# Altium schematic sheet MicroPlayerSCH.SchDoc
size A2; SheetNumber: 1; SheetTotal: 1
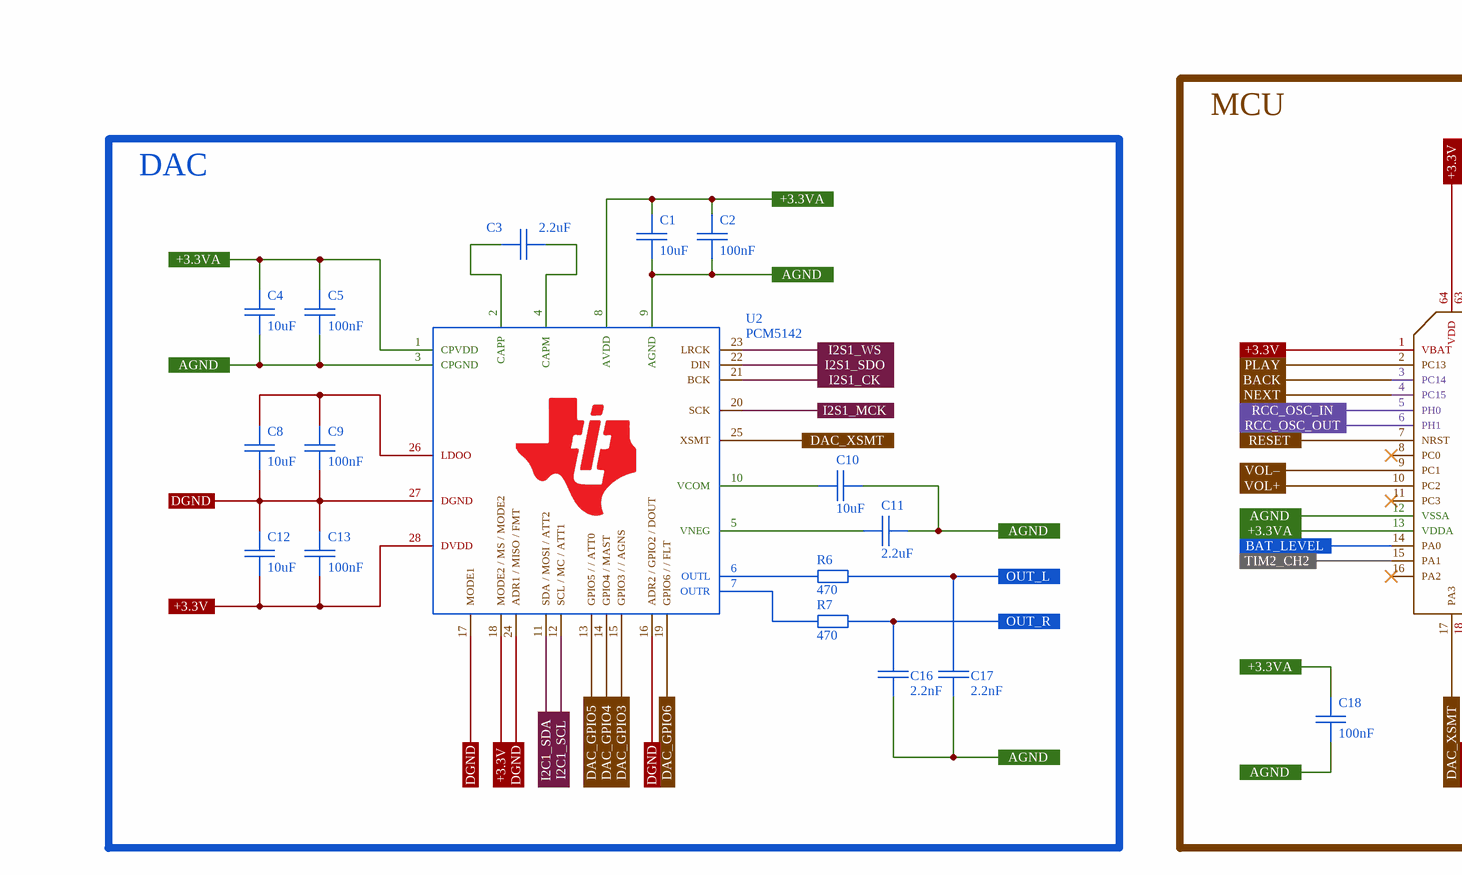
[diagram p0: MicroPlayerSCH.SchDoc, top left]
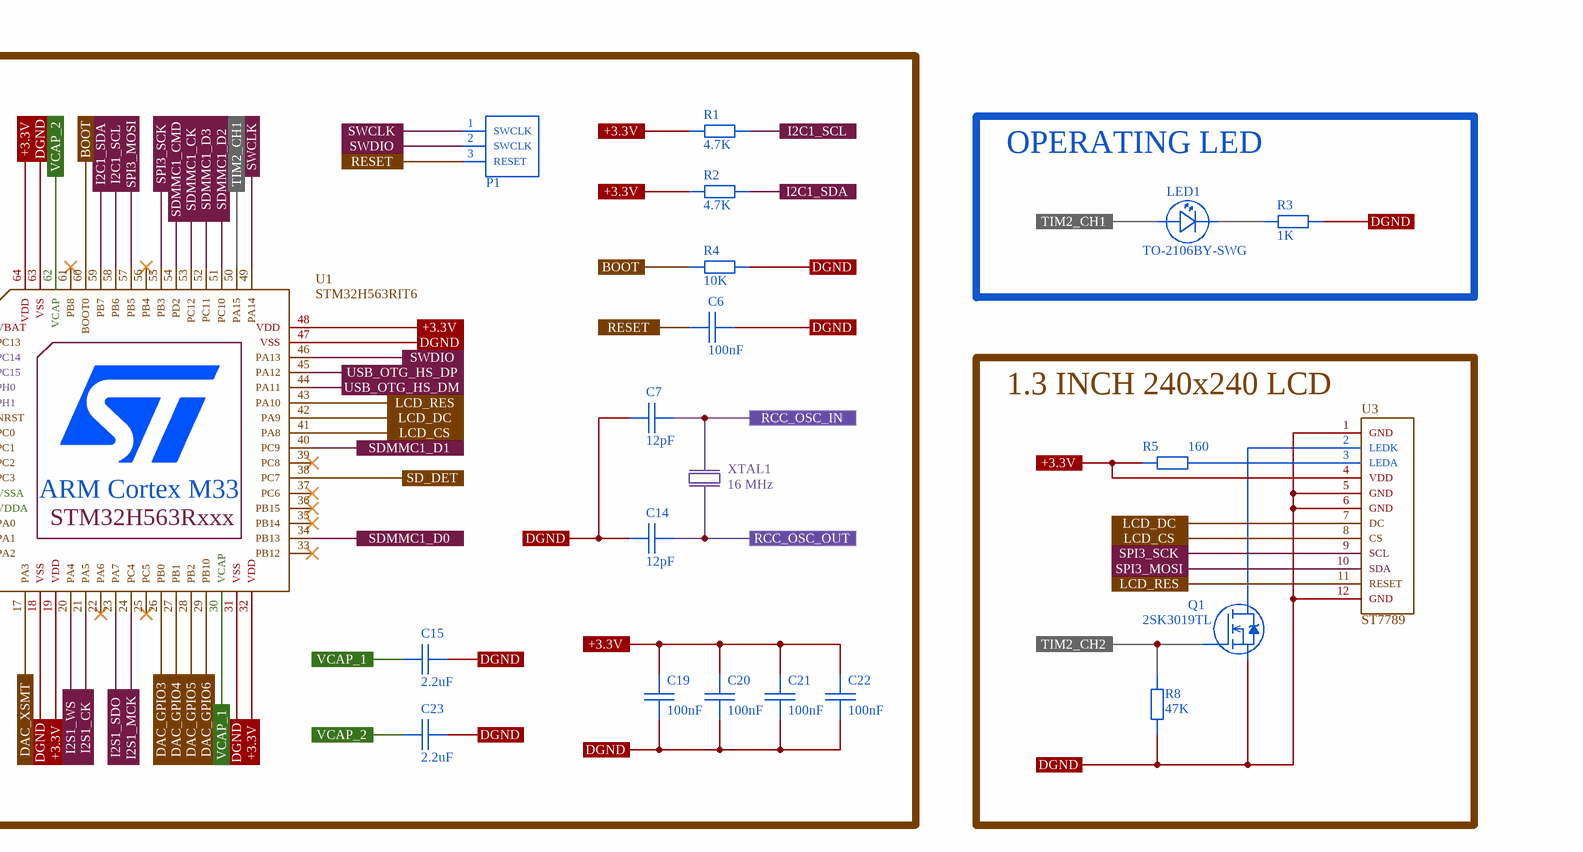
[diagram p1: MicroPlayerSCH.SchDoc, top right]
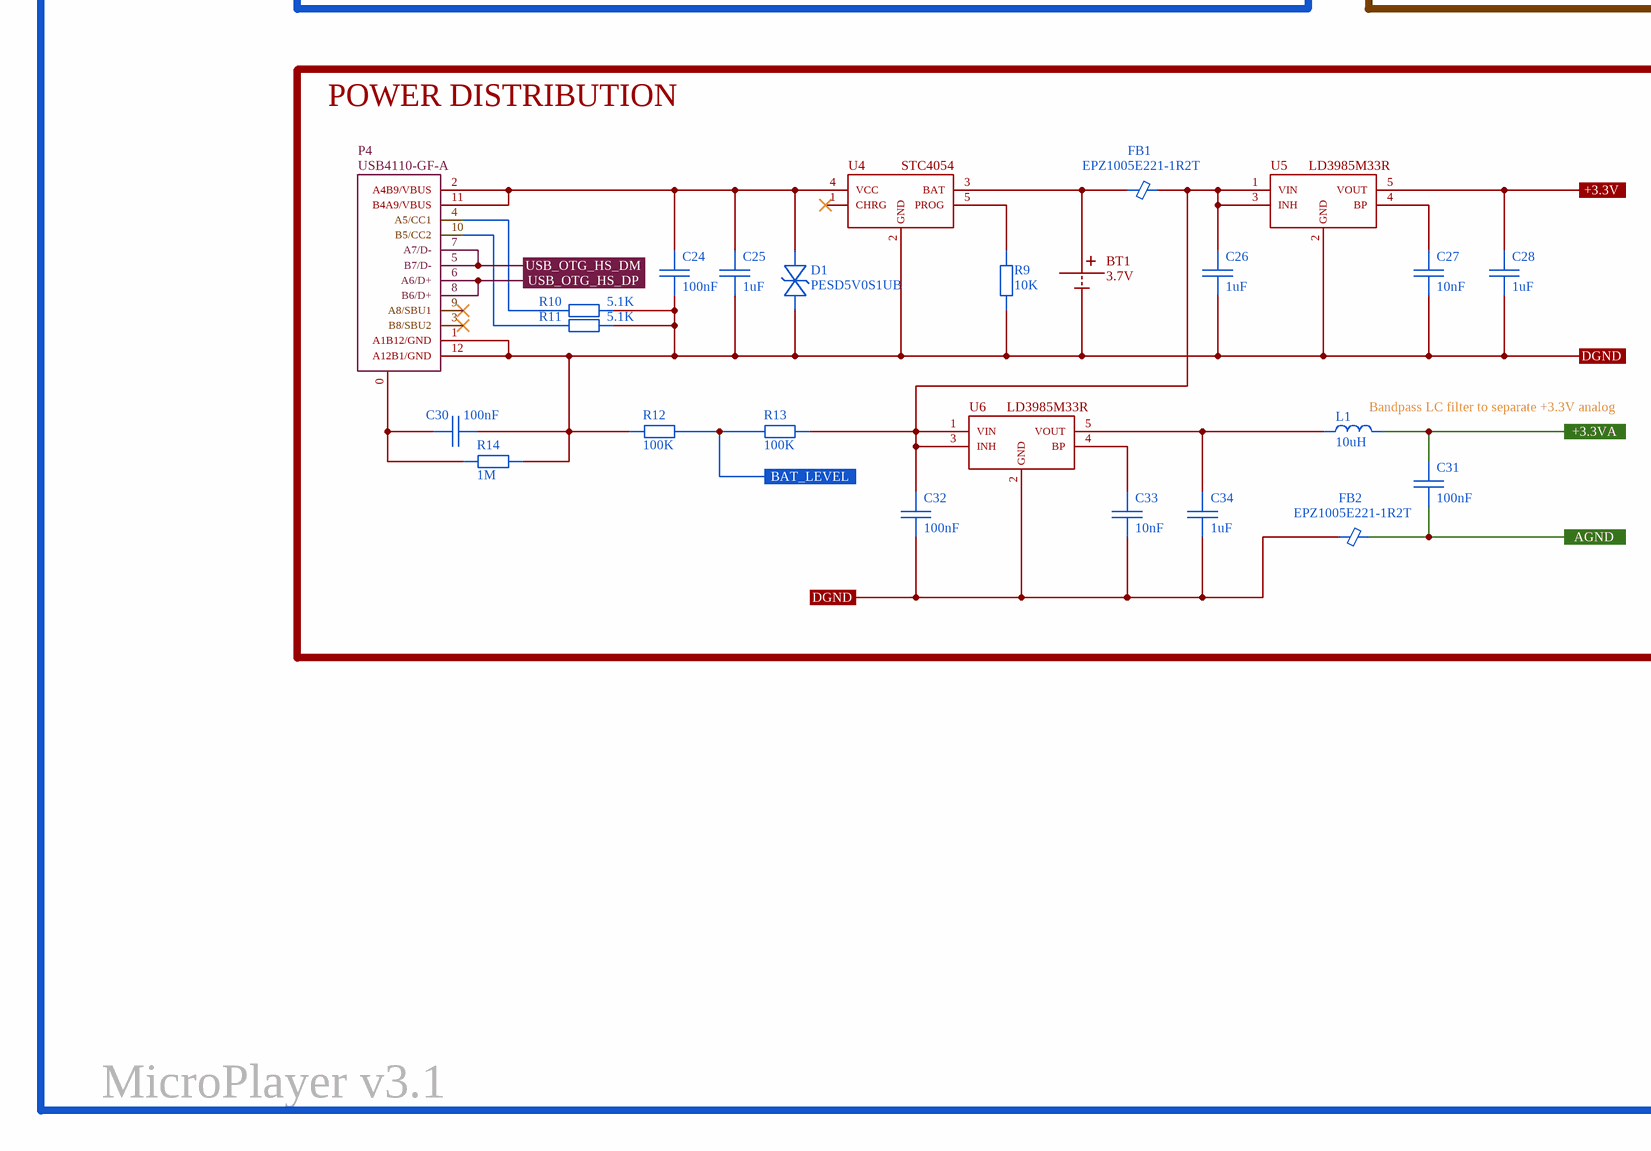
[diagram p2: MicroPlayerSCH.SchDoc, bottom left]
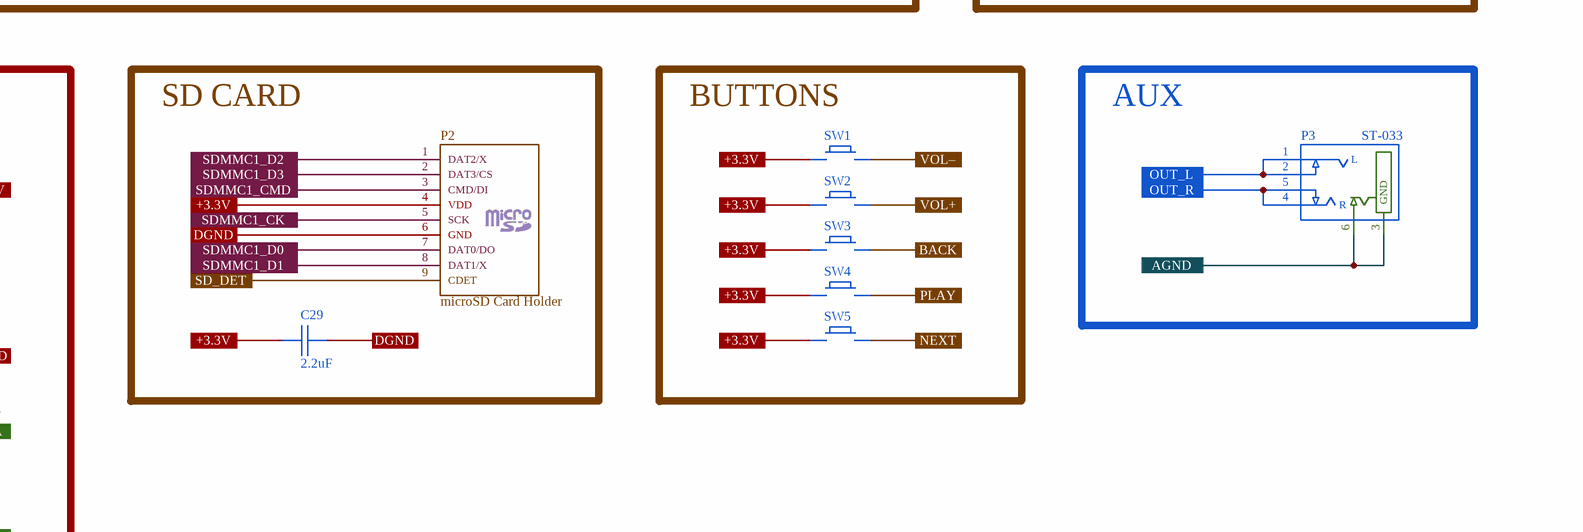
[diagram p3: MicroPlayerSCH.SchDoc, bottom right]

## Parts
BT1  3.7V  [_2-PAD-SM]
C1  10uF  [C0402]
C2  100nF  [C0402]
C3  2.2uF  [C0402]
C4  10uF  [C0402]
C5  100nF  [C0402]
C6  100nF  [C0402]
C7  12pF  [C0402]
C8  10uF  [C0402]
C9  100nF  [C0402]
C10  10uF  [C0402]
C11  2.2uF  [C0402]
C12  10uF  [C0402]
C13  100nF  [C0402]
C14  12pF  [C0402]
C15  2.2uF  [C0402]
C16  2.2nF  [C0402]
C17  2.2nF  [C0402]
C18  100nF  [C0402]
C19  100nF  [C0402]
C20  100nF  [C0402]
C21  100nF  [C0402]
C22  100nF  [C0402]
C23  2.2uF  [C0402]
C24  100nF  [C0402]
C25  1uF  [C0402]
C26  1uF  [C0402]
C27  10nF  [C0402]
C28  1uF  [C0402]
C29  2.2uF  [C0402]
C30  100nF  [C0402]
C31  100nF  [C0402]
C32  100nF  [C0402]
C33  10nF  [C0402]
C34  1uF  [C0402]
D1  PESD5V0S1UB  [SOD-523]
FB1  EPZ1005E221-1R2T  [L0402]
FB2  EPZ1005E221-1R2T  [L0402]
L1  10uH  [L0603]
LED1  TO-2106BY-SWG  [LED-2106-R/A]
P1  P3  [_3-PAD-SM]  (value not drawn)
P2  microSD Card Holder  [L-KLS1-TF-003]
P3  ST-033  [_3-PAD-TH]
P4  USB4110-GF-A  [USB-TYPE-C]
Q1  2SK3019TL  [SOT-416FL]
R1  4.7K  [R0402]
R2  4.7K  [R0402]
R3  1K  [R0402]
R4  10K  [R0402]
R5  160  [R0402]
R6  470  [R0402]
R7  470  [R0402]
R8  47K  [R0402]
R9  10K  [R0402]
R10  5.1K  [R0402]
R11  5.1K  [R0402]
R12  100K  [R0402]
R13  100K  [R0402]
R14  1M  [R0402]
SW1  (no value)  [BUT-SMD-4X3.5X2MM]
SW2  (no value)  [BUT-SMD-4X3.5X2MM]
SW3  (no value)  [BUT-SMD-4X3.5X2MM]
SW4  (no value)  [BUT-SMD-4X3.5X2MM]
SW5  (no value)  [BUT-SMD-4X3.5X2MM]
U1  STM32H563RIT6  [LQFP64]
U2  PCM5142  [TSSOP28]
U3  ST7789  [1.3INCH_LCD_WELDED]
U4  STC4054  [SOT-23-5]
U5  LD3985M33R  [SOT-23-5]
U6  LD3985M33R  [SOT-23-5]
XTAL1  16 MHz  [7U]

## Blocks framed on the sheet
MCU: C6 C7 C14 C15 C18-C23 P1 R1 R2 R4 U1 XTAL1
DAC: C1-C5 C8-C13 C16 C17 R6 R7 U2
OPERATING LED: LED1 R3
1.3 INCH 240x240 LCD: Q1 R5 R8 U3
POWER DISTRIBUTION: BT1 C24-C28 C30-C34 D1 FB1 FB2 L1 P4 R9-R14 U4-U6
SD CARD: C29 P2
BUTTONS: SW1-SW5
AUX: P3

## Ports
+3.3V (see MicroPlayerSCH[1B], MicroPlayerSCH[2B], MicroPlayerSCH[4A], MicroPlayerSCH[4B], MicroPlayerSCH[4C], MicroPlayerSCH[5B], MicroPlayerSCH[5C], MicroPlayerSCH[6A], MicroPlayerSCH[6B], MicroPlayerSCH[6C]), +3.3V (see MicroPlayerSCH[1B], MicroPlayerSCH[2B], MicroPlayerSCH[4A], MicroPlayerSCH[4B], MicroPlayerSCH[4C], MicroPlayerSCH[5B], MicroPlayerSCH[5C], MicroPlayerSCH[6A], MicroPlayerSCH[6B], MicroPlayerSCH[6C], MicroPlayerSCH[7B]), +3.3V (see MicroPlayerSCH[1B], MicroPlayerSCH[2B], MicroPlayerSCH[4A], MicroPlayerSCH[4B], MicroPlayerSCH[4C], MicroPlayerSCH[5B], MicroPlayerSCH[5C], MicroPlayerSCH[6B], MicroPlayerSCH[6C], MicroPlayerSCH[7B]), +3.3V (see MicroPlayerSCH[1B], MicroPlayerSCH[2B], MicroPlayerSCH[4A], MicroPlayerSCH[4B], MicroPlayerSCH[5B], MicroPlayerSCH[5C], MicroPlayerSCH[6A], MicroPlayerSCH[6B], MicroPlayerSCH[6C], MicroPlayerSCH[7B]), +3.3V (see MicroPlayerSCH[1B], MicroPlayerSCH[2B], MicroPlayerSCH[4B], MicroPlayerSCH[4C], MicroPlayerSCH[5B], MicroPlayerSCH[5C], MicroPlayerSCH[6A], MicroPlayerSCH[6B], MicroPlayerSCH[6C], MicroPlayerSCH[7B]), +3.3V (see MicroPlayerSCH[1B], MicroPlayerSCH[4A], MicroPlayerSCH[4B], MicroPlayerSCH[4C], MicroPlayerSCH[5B], MicroPlayerSCH[5C], MicroPlayerSCH[6A], MicroPlayerSCH[6B], MicroPlayerSCH[6C], MicroPlayerSCH[7B]), +3.3V (see MicroPlayerSCH[2B], MicroPlayerSCH[4A], MicroPlayerSCH[4B], MicroPlayerSCH[4C], MicroPlayerSCH[5B], MicroPlayerSCH[5C], MicroPlayerSCH[6A], MicroPlayerSCH[6B], MicroPlayerSCH[6C], MicroPlayerSCH[7B]), +3.3VA (see MicroPlayerSCH[1B], MicroPlayerSCH[3A], MicroPlayerSCH[4B]), +3.3VA (see MicroPlayerSCH[1B], MicroPlayerSCH[3A], MicroPlayerSCH[4B], MicroPlayerSCH[4C]), +3.3VA (see MicroPlayerSCH[1B], MicroPlayerSCH[4B], MicroPlayerSCH[4C]), +3.3VA (see MicroPlayerSCH[3A], MicroPlayerSCH[4B], MicroPlayerSCH[4C]), AGND (see MicroPlayerSCH[1B], MicroPlayerSCH[3B], MicroPlayerSCH[4B], MicroPlayerSCH[4C]), AGND (see MicroPlayerSCH[1B], MicroPlayerSCH[3B], MicroPlayerSCH[4B], MicroPlayerSCH[4C], MicroPlayerSCH[7C]), AGND (see MicroPlayerSCH[1B], MicroPlayerSCH[3B], MicroPlayerSCH[4B], MicroPlayerSCH[7C]), AGND (see MicroPlayerSCH[3B], MicroPlayerSCH[4B], MicroPlayerSCH[4C], MicroPlayerSCH[7C]), BACK (see MicroPlayerSCH[4B]), BACK (see MicroPlayerSCH[6C]), BAT_LEVEL (see MicroPlayerSCH[2C]), BAT_LEVEL (see MicroPlayerSCH[4B]), BOOT (see MicroPlayerSCH[5A]), BOOT (see MicroPlayerSCH[6B]), DAC_GPIO3 (see MicroPlayerSCH[2B]), DAC_GPIO3 (see MicroPlayerSCH[5B]), DAC_GPIO4 (see MicroPlayerSCH[2B]), DAC_GPIO4 (see MicroPlayerSCH[5B]), DAC_GPIO5 (see MicroPlayerSCH[2B]), DAC_GPIO5 (see MicroPlayerSCH[5B]), DAC_GPIO6 (see MicroPlayerSCH[3B]), DAC_GPIO6 (see MicroPlayerSCH[5B]), DAC_XSMT (see MicroPlayerSCH[3B]), DAC_XSMT (see MicroPlayerSCH[4B]), DGND (see MicroPlayerSCH[1B], MicroPlayerSCH[2B], MicroPlayerSCH[2D], MicroPlayerSCH[4A], MicroPlayerSCH[4B], MicroPlayerSCH[4C], MicroPlayerSCH[5B], MicroPlayerSCH[5C], MicroPlayerSCH[6B], MicroPlayerSCH[7B]), DGND (see MicroPlayerSCH[1B], MicroPlayerSCH[2B], MicroPlayerSCH[2D], MicroPlayerSCH[4A], MicroPlayerSCH[4B], MicroPlayerSCH[4C], MicroPlayerSCH[5B], MicroPlayerSCH[5C], MicroPlayerSCH[6B], MicroPlayerSCH[7B], MicroPlayerSCH[8B]), DGND (see MicroPlayerSCH[1B], MicroPlayerSCH[2B], MicroPlayerSCH[2D], MicroPlayerSCH[4A], MicroPlayerSCH[4B], MicroPlayerSCH[4C], MicroPlayerSCH[5B], MicroPlayerSCH[5C], MicroPlayerSCH[6B], MicroPlayerSCH[8B]), DGND (see MicroPlayerSCH[1B], MicroPlayerSCH[2B], MicroPlayerSCH[2D], MicroPlayerSCH[4A], MicroPlayerSCH[4B], MicroPlayerSCH[5B], MicroPlayerSCH[5C], MicroPlayerSCH[6B], MicroPlayerSCH[7B], MicroPlayerSCH[8B]), DGND (see MicroPlayerSCH[1B], MicroPlayerSCH[2B], MicroPlayerSCH[2D], MicroPlayerSCH[4A], MicroPlayerSCH[4C], MicroPlayerSCH[5B], MicroPlayerSCH[5C], MicroPlayerSCH[6B], MicroPlayerSCH[7B], MicroPlayerSCH[8B]), DGND (see MicroPlayerSCH[1B], MicroPlayerSCH[2B], MicroPlayerSCH[2D], MicroPlayerSCH[4B], MicroPlayerSCH[4C], MicroPlayerSCH[5B], MicroPlayerSCH[5C], MicroPlayerSCH[6B], MicroPlayerSCH[7B], MicroPlayerSCH[8B]), DGND (see MicroPlayerSCH[1B], MicroPlayerSCH[2B], MicroPlayerSCH[4A], MicroPlayerSCH[4B], MicroPlayerSCH[4C], MicroPlayerSCH[5B], MicroPlayerSCH[5C], MicroPlayerSCH[6B], MicroPlayerSCH[7B], MicroPlayerSCH[8B]), DGND (see MicroPlayerSCH[2B], MicroPlayerSCH[2D], MicroPlayerSCH[4A], MicroPlayerSCH[4B], MicroPlayerSCH[4C], MicroPlayerSCH[5B], MicroPlayerSCH[5C], MicroPlayerSCH[6B], MicroPlayerSCH[7B], MicroPlayerSCH[8B]), I2C1_SCL (see MicroPlayerSCH[2B], MicroPlayerSCH[5B]), I2C1_SCL (see MicroPlayerSCH[2B], MicroPlayerSCH[6A]), I2C1_SCL (see MicroPlayerSCH[5B], MicroPlayerSCH[6A]), I2C1_SDA (see MicroPlayerSCH[2B], MicroPlayerSCH[5B]), I2C1_SDA (see MicroPlayerSCH[2B], MicroPlayerSCH[6B]), I2C1_SDA (see MicroPlayerSCH[5B], MicroPlayerSCH[6B]), I2S1_CK (see MicroPlayerSCH[3B]), I2S1_CK (see MicroPlayerSCH[5B]), I2S1_MCK (see MicroPlayerSCH[3B]), I2S1_MCK (see MicroPlayerSCH[5B]), I2S1_SDO (see MicroPlayerSCH[3B]), I2S1_SDO (see MicroPlayerSCH[5B]), I2S1_WS (see MicroPlayerSCH[3B]), I2S1_WS (see MicroPlayerSCH[4B]), LCD_CS (see MicroPlayerSCH[5B]), LCD_CS (see MicroPlayerSCH[7B]), LCD_DC (see MicroPlayerSCH[5B]), LCD_DC (see MicroPlayerSCH[7B]), LCD_RES (see MicroPlayerSCH[5B]), LCD_RES (see MicroPlayerSCH[7B]), NEXT (see MicroPlayerSCH[4B]), NEXT (see MicroPlayerSCH[6C]), OUT_L (see MicroPlayerSCH[3B]), OUT_L (see MicroPlayerSCH[7C]), OUT_R (see MicroPlayerSCH[3B]), OUT_R (see MicroPlayerSCH[7C]), PLAY (see MicroPlayerSCH[4B]), PLAY (see MicroPlayerSCH[6C]), RCC_OSC_IN (see MicroPlayerSCH[4B]), RCC_OSC_IN (see MicroPlayerSCH[6B]), RCC_OSC_OUT (see MicroPlayerSCH[4B]), RCC_OSC_OUT (see MicroPlayerSCH[6B]), RESET (see MicroPlayerSCH[4B], MicroPlayerSCH[5A]), RESET (see MicroPlayerSCH[4B], MicroPlayerSCH[6B]), RESET (see MicroPlayerSCH[5A], MicroPlayerSCH[6B]), SD_DET (see MicroPlayerSCH[5B]), SD_DET (see MicroPlayerSCH[5C]), SDMMC1_CK (see MicroPlayerSCH[5B]), SDMMC1_CK (see MicroPlayerSCH[5C]), SDMMC1_CMD (see MicroPlayerSCH[5B]), SDMMC1_CMD (see MicroPlayerSCH[5C]), SDMMC1_D0 (see MicroPlayerSCH[5B]), SDMMC1_D0 (see MicroPlayerSCH[5C]), SDMMC1_D1 (see MicroPlayerSCH[5B]), SDMMC1_D1 (see MicroPlayerSCH[5C]), SDMMC1_D2 (see MicroPlayerSCH[5B]), SDMMC1_D2 (see MicroPlayerSCH[5C]), SDMMC1_D3 (see MicroPlayerSCH[5B]), SDMMC1_D3 (see MicroPlayerSCH[5C]), SPI3_MOSI (see MicroPlayerSCH[5B]), SPI3_MOSI (see MicroPlayerSCH[7B]), SPI3_SCK (see MicroPlayerSCH[5B]), SPI3_SCK (see MicroPlayerSCH[7B]), SWCLK (see MicroPlayerSCH[5A]), SWDIO (see MicroPlayerSCH[5A]), SWDIO (see MicroPlayerSCH[5B]), TIM2_CH1 (see MicroPlayerSCH[5B]), TIM2_CH1 (see MicroPlayerSCH[7B]), TIM2_CH2 (see MicroPlayerSCH[4B]), TIM2_CH2 (see MicroPlayerSCH[7B]), USB_OTG_HS_DM (see MicroPlayerSCH[2C]), USB_OTG_HS_DM (see MicroPlayerSCH[5B]), USB_OTG_HS_DP (see MicroPlayerSCH[2C]), USB_OTG_HS_DP (see MicroPlayerSCH[5B]), VCAP_1 (see MicroPlayerSCH[5B]), VCAP_2 (see MicroPlayerSCH[4A]), VCAP_2 (see MicroPlayerSCH[5B]), VOL+ (see MicroPlayerSCH[4B]), VOL+ (see MicroPlayerSCH[6C]), VOL– (see MicroPlayerSCH[4B]), VOL– (see MicroPlayerSCH[6C])

## Nets
+3.3V: C12.2 C13.2 C19.2 C20.2 C21.2 C22.2 C28.2 C29.1 P2.4(VDD) R1.1 R2.1 R5.1 SW1.1 SW2.1 SW3.1 SW4.1 SW5.1 U1.1(VBAT) U1.19(VDD) U1.32(VDD) U1.48(VDD) U1.64(VDD) U2.18(MODE2_/_MS_/_MODE2) U2.28(DVDD) U3.4(VDD) U5.5(VOUT) ; port +3.3V
+3.3VA: C1.1 C2.1 C4.1 C5.1 C18.2 C31.1 L1.2 U1.13(VDDA) U2.1(CPVDD) U2.8(AVDD) ; port +3.3VA
AGND: C1.2 C2.2 C4.2 C5.2 C10.2 C11.2 C16.1 C17.1 C18.1 C31.2 FB2.2 P3.3(GND) P3.6 U1.12(VSSA) U2.3(CPGND) U2.9(AGND) ; port AGND
BACK: SW3.2 U1.3(PC14) ; port BACK
BAT_LEVEL: R12.1 R13.2 U1.14(PA0) ; port BAT_LEVEL
BOOT: R4.1 U1.60(BOOT0) ; port BOOT
DAC_GPIO3: U1.26(PB0) U2.15(GPIO3_/_/_AGNS) ; port DAC_GPIO3
DAC_GPIO4: U1.27(PB1) U2.14(GPIO4_/_MAST) ; port DAC_GPIO4
DAC_GPIO5: U1.28(PB2) U2.13(GPIO5_/_/_ATT0) ; port DAC_GPIO5
DAC_GPIO6: U1.29(PB10) U2.19(GPIO6_/_/_FLT) ; port DAC_GPIO6
DAC_XSMT: U1.17(PA3) U2.25(XSMT) ; port DAC_XSMT
DGND: BT1.2 C6.1 C7.2 C8.2 C9.2 C12.1 C13.1 C14.2 C15.1 C19.1 C20.1 C21.1 C22.1 C23.1 C24.1 C25.2 C26.1 C27.1 C28.1 C29.2 C30.1 C32.1 C33.1 C34.1 D1.1 FB2.1 P2.6(GND) P4.1(A1B12/GND) P4.12(A12B1/GND) Q1.2(S) R3.1 R4.2 R8.1 R9.1 R10.1 R11.1 R12.2 R14.1 U1.18(VSS) U1.31(VSS) U1.47(VSS) U1.63(VSS) U2.16(ADR2_/_GPIO2_/_DOUT) U2.17(MODE1) U2.24(ADR1_/_MISO_/_FMT) U2.27(DGND) U3.1(GND) U3.5(GND) U3.6(GND) U3.12(GND) U4.2(GND) U5.2(GND) U6.2(GND) ; port DGND
I2C1_SCL: R1.2 U1.58(PB6) U2.12(SCL_/_MC_/_ATT1) ; port I2C1_SCL
I2C1_SDA: R2.2 U1.59(PB7) U2.11(SDA_/_MOSI_/_ATT2) ; port I2C1_SDA
I2S1_CK: U1.21(PA5) U2.21(BCK) ; port I2S1_CK
I2S1_MCK: U1.24(PC4) U2.20(SCK) ; port I2S1_MCK
I2S1_SDO: U1.23(PA7) U2.22(DIN) ; port I2S1_SDO
I2S1_WS: U1.20(PA4) U2.23(LRCK) ; port I2S1_WS
LCD_CS: U1.41(PA8) U3.8(CS) ; port LCD_CS
LCD_DC: U1.42(PA9) U3.7(DC) ; port LCD_DC
LCD_RES: U1.43(PA10) U3.11(RESET) ; port LCD_RES
NEXT: SW5.2 U1.4(PC15) ; port NEXT
OUT_L: C17.2 P3.1(L) P3.2 R6.1 ; port OUT_L
OUT_R: C16.2 P3.4(R) P3.5 R7.1 ; port OUT_R
PLAY: SW4.2 U1.2(PC13) ; port PLAY
RCC_OSC_IN: C7.1 U1.5(PH0) XTAL1.1 ; port RCC_OSC_IN
RCC_OSC_OUT: C14.1 U1.6(PH1) XTAL1.2 ; port RCC_OSC_OUT
RESET: C6.2 P1.3(RESET) U1.7(NRST) ; port RESET
SD_DET: P2.9(CDET) U1.38(PC7) ; port SD_DET
SDMMC1_CK: P2.5(SCK) U1.53(PC12) ; port SDMMC1_CK
SDMMC1_CMD: P2.3(CMD/DI) U1.54(PD2) ; port SDMMC1_CMD
SDMMC1_D0: P2.7(DAT0/DO) U1.34(PB13) ; port SDMMC1_D0
SDMMC1_D1: P2.8(DAT1/X) U1.40(PC9) ; port SDMMC1_D1
SDMMC1_D2: P2.1(DAT2/X) U1.51(PC10) ; port SDMMC1_D2
SDMMC1_D3: P2.2(DAT3/CS) U1.52(PC11) ; port SDMMC1_D3
SPI3_MOSI: U1.57(PB5) U3.10(SDA) ; port SPI3_MOSI
SPI3_SCK: U1.55(PB3) U3.9(SCL) ; port SPI3_SCK
SWCLK: P1.1(SWCLK) U1.49(PA14) ; port SWCLK
SWDIO: P1.2(SWCLK) U1.46(PA13) ; port SWDIO
TIM2_CH1: LED1.1(Anode) U1.50(PA15) ; port TIM2_CH1
TIM2_CH2: Q1.1(G) R8.2 U1.15(PA1) ; port TIM2_CH2
USB_OTG_HS_DM: P4.5(B7/D-) P4.7(A7/D-) U1.44(PA11) ; port USB_OTG_HS_DM
USB_OTG_HS_DP: P4.6(A6/D+) P4.8(B6/D+) U1.45(PA12) ; port USB_OTG_HS_DP
VCAP_1: C15.2 U1.30(VCAP) ; port VCAP_1
VCAP_2: C23.2 U1.62(VCAP) ; port VCAP_2
VOL+: SW2.2 U1.10(PC2) ; port VOL+
VOL–: SW1.2 U1.9(PC1) ; port VOL–
NetBT1_1: BT1.1 FB1.1 U4.3(BAT)
NetC3_1: C3.1 U2.2(CAPP)
NetC3_2: C3.2 U2.4(CAPM)
NetC8_1: C8.1 C9.1 U2.26(LDOO)
NetC10_1: C10.1 U2.10(VCOM)
NetC11_1: C11.1 U2.5(VNEG)
NetC24_2: C24.2 C25.1 D1.2 P4.2(A4B9/VBUS) P4.11(B4A9/VBUS) U4.4(VCC)
NetC26_2: C26.2 C32.2 FB1.2 R13.1 U5.1(VIN) U5.3(INH) U6.1(VIN) U6.3(INH)
NetC27_2: C27.2 U5.4(BP)
NetC30_2: C30.2 P4.0 R14.2
NetC33_2: C33.2 U6.4(BP)
NetC34_2: C34.2 L1.1 U6.5(VOUT)
NetLED1_2: LED1.2(Cathode) R3.2
NetP4_4: P4.4(A5/CC1) R10.2
NetP4_10: P4.10(B5/CC2) R11.2
NetQ1_3: Q1.3(D) U3.2(LEDK)
NetR5_2: R5.2 U3.3(LEDA)
NetR6_2: R6.2 U2.6(OUTL)
NetR7_2: R7.2 U2.7(OUTR)
NetR9_2: R9.2 U4.5(PROG)

Not connected (* = marked no-connect by the designer): P4 3(B8/SBU2)* 9(A8/SBU1)*; U1 8(PC0)* 11(PC3)* 16(PA2)* 22(PA6)* 25(PC5)* 33(PB12)* 35(PB14)* 36(PB15)* 37(PC6)* 39(PC8)* 56(PB4)* 61(PB8)*; U4 1(CHRG)*

## Notes on the sheet
- (near L1) Bandpass LC filter to separate +3.3V analog
- MicroPlayer v3.1
- (in symbol STM32H563Rxxx) ARM Cortex M33

## Library data of the parts
BT1 = Battery: Name: LP303030; Value: 3.7V; Link: https://www.chipdip.ru/product/robiton-lp303030
C1-C34 = Cap: Voltage: 250V; Tolerance: 5%
  C1 C4 C8 C10 C12: Value: 10uF; Case: DNP; Part Number: N/A; Link: *; Note: *
  C2 C5 C9 C13 C31: Value: 100nF; Case: 0603
  C3 C11 C15 C23 C29: Value: 2.2uF; Case: DNP; Part Number: N/A; Link: *; Note: *
  C6 C18-C22 C24 C30 C32: Value: 100nF; Case: DNP; Part Number: N/A; Link: *; Note: *
  C7 C14: Value: 12pF; Case: 0603
  C16 C17: Value: 2.2nF; Case: DNP; Part Number: N/A; Link: *; Note: *
  C25 C26 C28 C34: Value: 1uF; Case: DNP; Part Number: N/A; Link: *; Note: *
  C27 C33: Value: 10nF; Case: DNP; Part Number: N/A; Link: *; Note: *
D1 = Suppressor: Name: PESD5V0S1UB; Case: SOD-523; Link: https://www.chipdip.ru/product/pesd5v0s1ub
FB1 FB2 = Ferrite Bead: Value: 100uH; Name: EPZ1005E221-1R2T; Case: 0402
L1 = Inductor: Part Number: LQM21FN100N00K; Tolerance: 30%; Value: 10uH; Case: 0805; Link: https://www.chipdip.ru/product/lqm21fn100n
LED1 = LED: Name: TO-2106BY-SWG; Case: DNP; Part Number: N/A
P2 = MicroSD-CD1: Name: microSD Card Holder
P3 = AJack Socket Stereo: pin to pad: 2>1 4>2 5>2 6>3; Name: ST-033
P4 = USB Type C with 0: Name: USB4110-GF-A; Case: DNP; Part Number: N/A; Link: *; Note: *
Q1 = MOSFET-N: Name: 2SK3019TL; Case: SOT-416; Link: https://www.chipdip.ru/product/2n7002-umw
R1-R14 = Res: Tolerance: 5%; Power: 0.125W
  R1 R2: Value: 4.7K
  R3: Value: 1K; Case: 0603
  R4 R9: Value: 10K
  R5: Value: 160
  R6 R7: Value: 470
  R8: Value: 47K
  R10 R11: Value: 5.1K
  R12 R13: Value: 100K
  R14: Value: 1M
SW1-SW5 = Button
U1 = STM32H563Rxxx: Name: STM32H563RIT6; Case: DNP; Part Number: N/A
U2 = PCM514x: 2-VRMS DirectPath™, 112/106-dB Audio Stereo DAC With 32-bit, 384-kHz PCM Interface; Name: PCM5142; Case: DNP; Part Number: N/A; Link: *; Note: *
U3 = 1.3inch TFT LCD 12-pin: 135x240 Display; Name: ST7789; Part Number: N/A
U4 = STC4054: 800mA Standalone linear Li-Ion Battery charger with thermal regulation; Name: STC4054; Case: SOT-23-5; Part Number: N/A
U5 U6 = LD3985: Ultra low drop and low noise BiCMOS voltage regulators, 150 mA; Name: LD3985M33R; Case: SOT-23-5; Link: https://www.chipdip.ru/product/ld3985m33r
XTAL1 = Crystal: Name: SJK-7U; Tolerance: 0.001%; Value: 16 MHz; Case: 7U; Part Number: N/A
P1 = P3: Case: DNP; Part Number: N/A